# Altium project Pulse.PrjPCB
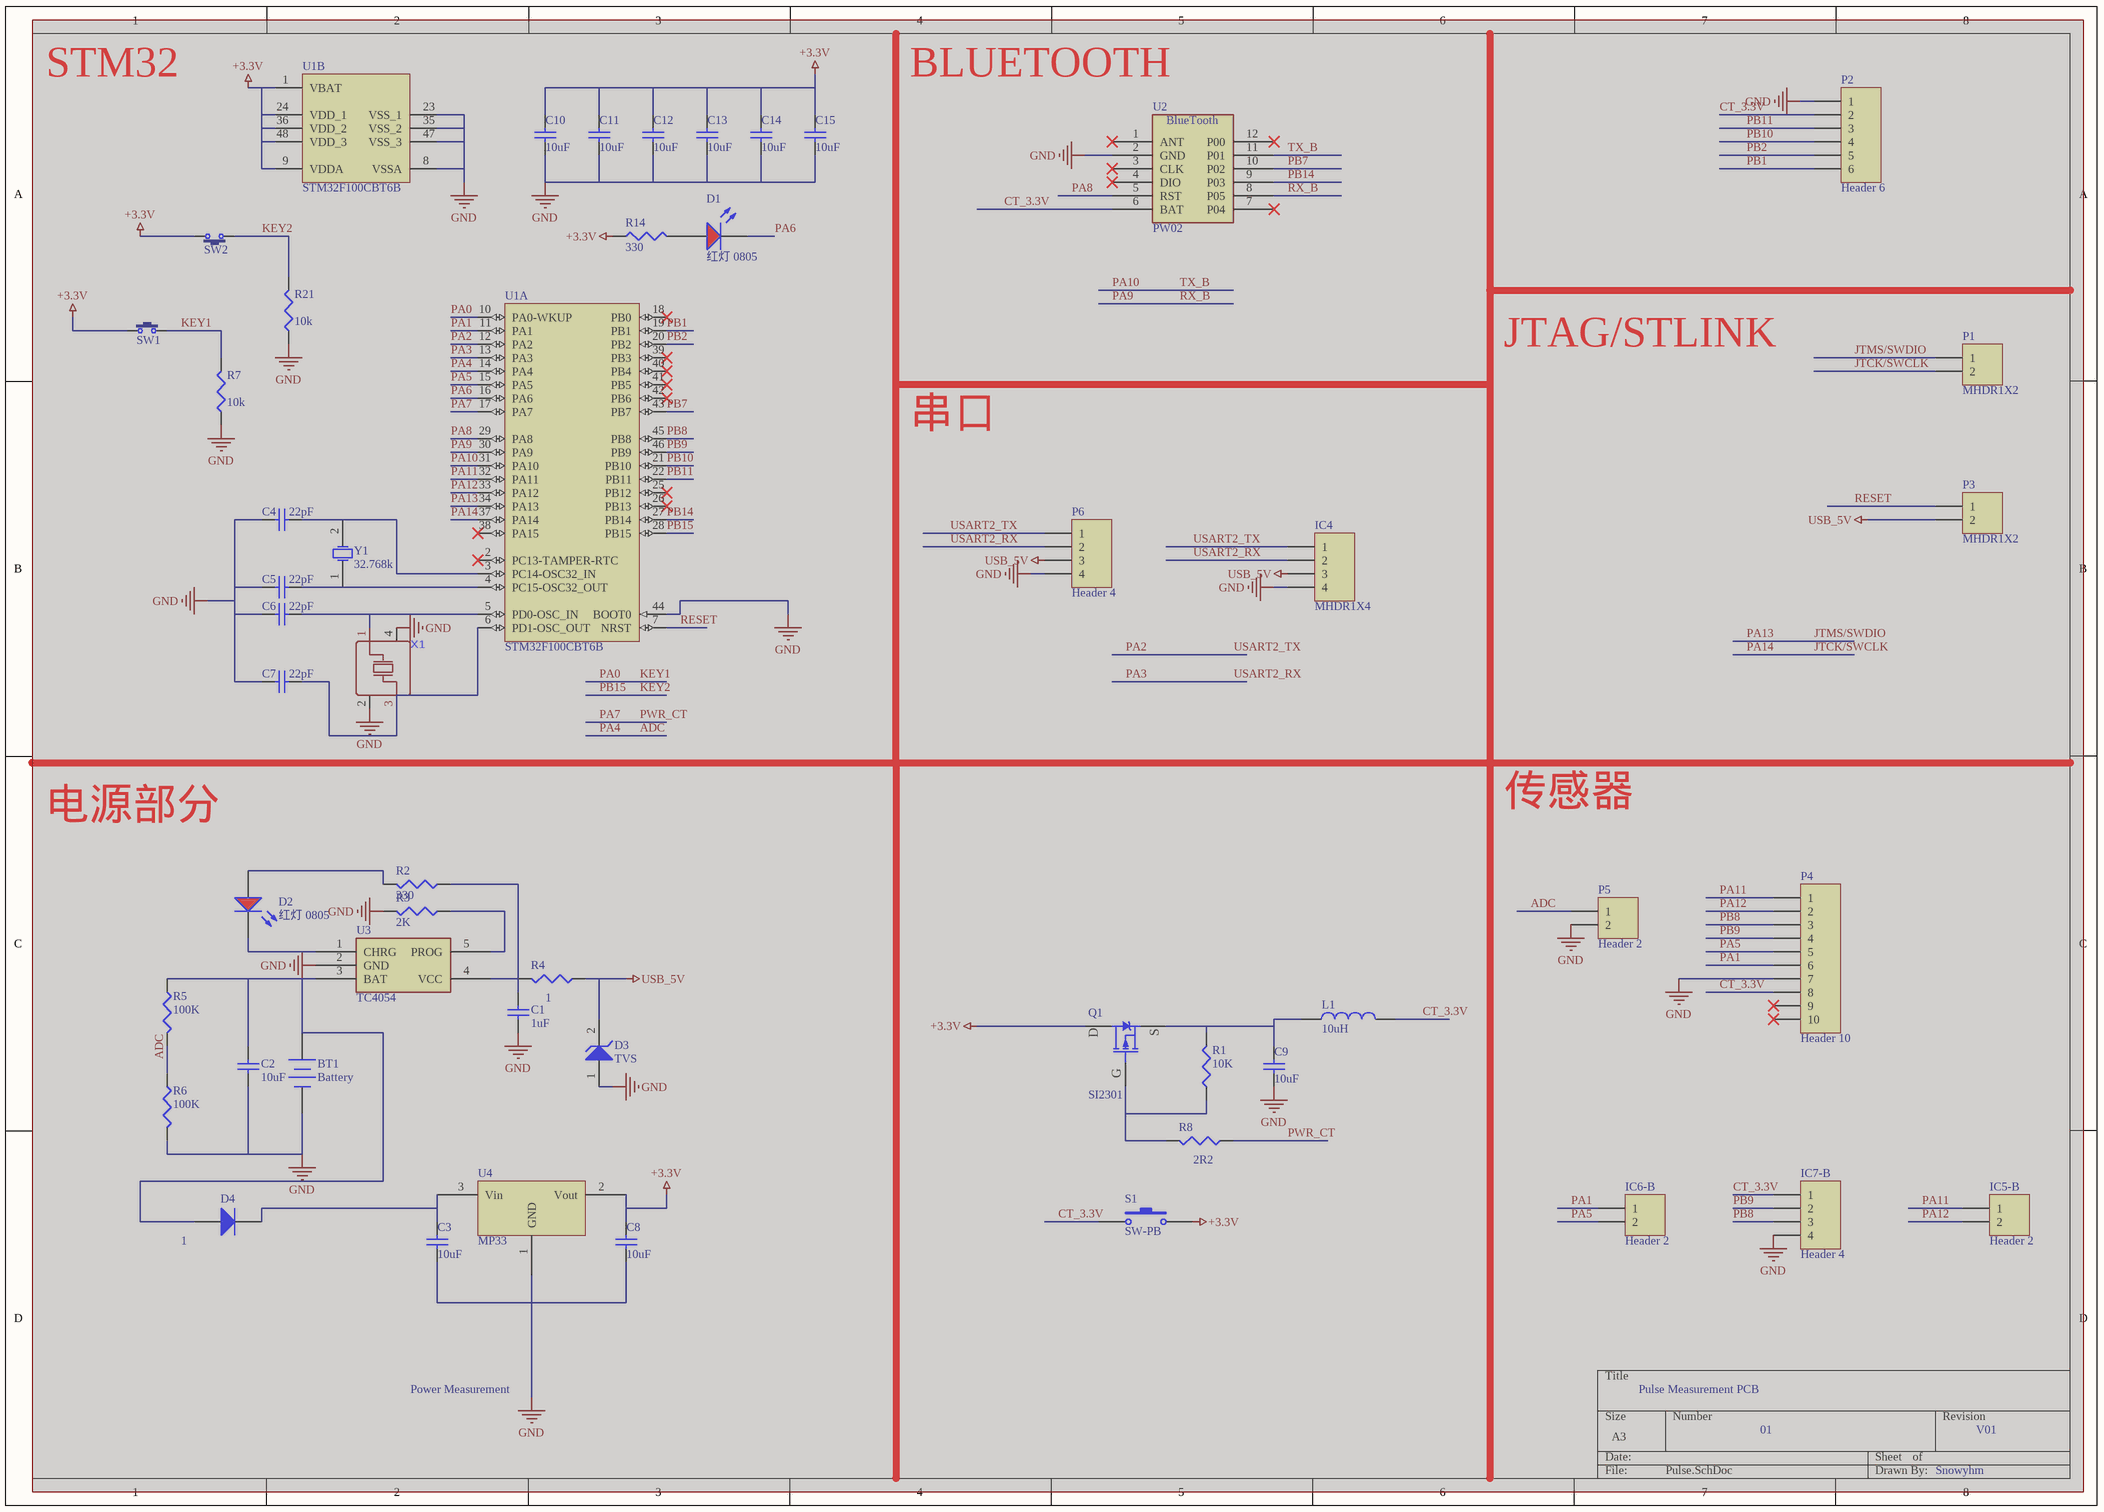
[diagram p0: Pulse.SchDoc]
3 sheets, 148 parts. Net scope: global (net labels, ports and power ports of the same name join across sheets).
Board file: Pulse.PcbDoc
Sheets:
  Pulse.SchDoc
  Pulse2.SchDoc
  Pulse3.SchDoc

## Sheet Pulse.SchDoc
size A3

### Parts
(Parts that share a designator on the sheet are numbered #1, #2 ... from top to bottom, then left to right.)
BT1#1  Battery  [BAT-2]  (masked out: inside a compile mask, not in the netlist)
C1#1  value 1uF  [LC-0603_C]  (hidden comment: Cap Semi)  (masked out: inside a compile mask, not in the netlist)
C2#1  value 10uF  [LC-0603_C]  (hidden comment: Cap Semi)  (masked out: inside a compile mask, not in the netlist)
C3#1  value 10uF  [LC-0603_C]  (hidden comment: Cap Semi)  (masked out: inside a compile mask, not in the netlist)
C4#1  value 22pF  [LC-0603_C]  (hidden comment: Cap Semi)  (masked out: inside a compile mask, not in the netlist)
C5#1  value 22pF  [LC-0603_C]  (hidden comment: Cap Semi)  (masked out: inside a compile mask, not in the netlist)
C6#1  value 22pF  [LC-0603_C]  (hidden comment: Cap Semi)  (masked out: inside a compile mask, not in the netlist)
C7#1  value 22pF  [LC-0603_C]  (hidden comment: Cap Semi)  (masked out: inside a compile mask, not in the netlist)
C8#1  value 10uF  [LC-0603_C]  (hidden comment: Cap Semi)  (masked out: inside a compile mask, not in the netlist)
C9#1  value 10uF  [LC-0603_C]  (hidden comment: Cap Semi)  (masked out: inside a compile mask, not in the netlist)
C10#1  value 10uF  [LC-0603_C]  (hidden comment: Cap Semi)  (masked out: inside a compile mask, not in the netlist)
C11#1  value 10uF  [LC-0603_C]  (hidden comment: Cap Semi)  (masked out: inside a compile mask, not in the netlist)
C12#1  value 10uF  [LC-0603_C]  (hidden comment: Cap Semi)  (masked out: inside a compile mask, not in the netlist)
C13#1  value 10uF  [LC-0603_C]  (hidden comment: Cap Semi)  (masked out: inside a compile mask, not in the netlist)
C14#1  value 10uF  [LC-0603_C]  (hidden comment: Cap Semi)  (masked out: inside a compile mask, not in the netlist)
C15#1  value 10uF  [LC-0603_C]  (hidden comment: Cap Semi)  (masked out: inside a compile mask, not in the netlist)
D1#1  红灯 0805  [LC-0805_LED_S1]  (masked out: inside a compile mask, not in the netlist)
D2  红灯 0805  [LC-0805_LED_S1]  (masked out: inside a compile mask, not in the netlist)
D3  TVS  [LC-SOD-123]  (masked out: inside a compile mask, not in the netlist)
D4  1  [LC-SOD-123]  (masked out: inside a compile mask, not in the netlist)
IC4#1  MHDR1X4  [MHDR1X4]  (masked out: inside a compile mask, not in the netlist)
IC5-B  Header 2  [HDR1X2]  (masked out: inside a compile mask, not in the netlist)
IC6-B  Header 2  [HDR1X2]  (masked out: inside a compile mask, not in the netlist)
IC7-B  Header 4  [HDR1X4]  (masked out: inside a compile mask, not in the netlist)
L1  10uH  [L 0805]  (masked out: inside a compile mask, not in the netlist)
P1  MHDR1X2  [MHDR1X2]  (masked out: inside a compile mask, not in the netlist)
P2  Header 6  [HDR1X6]  (masked out: inside a compile mask, not in the netlist)
P3  MHDR1X2  [MHDR1X2]  (masked out: inside a compile mask, not in the netlist)
P4  Header 10  [8P]  (masked out: inside a compile mask, not in the netlist)
P5  Header 2  [HDR1X2]  (masked out: inside a compile mask, not in the netlist)
P6  Header 4  [fpc_4p]  (masked out: inside a compile mask, not in the netlist)
Q1#1  SI2301  [SOT23-3N]  (masked out: inside a compile mask, not in the netlist)
R1#1  value 10K  [LC-0603_R]  (hidden comment: Res3)  (masked out: inside a compile mask, not in the netlist)
R2#1  value 330  [LC-0603_R]  (hidden comment: Res3)  (masked out: inside a compile mask, not in the netlist)
R3#1  value 2K  [LC-0603_R]  (hidden comment: Res3)  (masked out: inside a compile mask, not in the netlist)
R4#1  value 1  [LC-0603_R]  (hidden comment: Res3)  (masked out: inside a compile mask, not in the netlist)
R5#1  value 100K  [LC-0603_R]  (hidden comment: Res3)  (masked out: inside a compile mask, not in the netlist)
R6#1  value 100K  [LC-0603_R]  (hidden comment: Res3)  (masked out: inside a compile mask, not in the netlist)
R7#1  value 10k  [LC-0603_R]  (hidden comment: Res3)  (masked out: inside a compile mask, not in the netlist)
R8#1  value 2R2  [LC-0603_R]  (hidden comment: Res3)  (masked out: inside a compile mask, not in the netlist)
R14#1  value 330  [LC-0603_R]  (hidden comment: Res3)  (masked out: inside a compile mask, not in the netlist)
R21#1  value 10k  [LC-0603_R]  (hidden comment: Res3)  (masked out: inside a compile mask, not in the netlist)
S1  SW-PB  [SW-SMD_DSHP01TSGET]  (masked out: inside a compile mask, not in the netlist)
SW1#1  3x6x5  [button]  (value not drawn)  (masked out: inside a compile mask, not in the netlist)
SW2#1  3x6x5  [button]  (value not drawn)  (masked out: inside a compile mask, not in the netlist)
U1#1  STM32F100CBT6B  [STM-LQFP48_L]  (parts A,B of 2)  (masked out: inside a compile mask, not in the netlist)
U2#1  PW02  [bluetooth]  (masked out: inside a compile mask, not in the netlist)
U3#1  TC4054  [SOT23-5]  (masked out: inside a compile mask, not in the netlist)
U4#1  MP33  [LC-SOT-23(SOT-23-3)]  (masked out: inside a compile mask, not in the netlist)
X1  (no value)  [OSC 3225-4P]  (masked out: inside a compile mask, not in the netlist)
Y1#1  32.768k  [OSC 3215-2P]  (masked out: inside a compile mask, not in the netlist)

### Notes on the sheet
- STM32
- BLUETOOTH
- JTAG/STLINK
- 串口
- 电源部分
- 传感器
- Power Measurement
- Pulse Measurement PCB
- 01
- V01
- Snowyhm

### Library data of the parts
BT1#1 = Battery: Multicell Battery; Published: 24-Mar-1999; LatestRevisionDate: 17-Jul-2002; LatestRevisionNote: Re-released for DXP Platform.; PackageReference: BAT-2; Publisher: Altium Limited; PackageDescription: Battery; 2 Leads
C1#1 C2#1 C3#1 C4#1 C5#1 C6#1 C7#1 C8#1 C9#1 C10#1 C11#1 C12#1 C13#1 C14#1 C15#1 = Cap Semi: Capacitor (Semiconductor SIM Model); Published: 8-Jun-2000; LatestRevisionDate: 29-May-2009; LatestRevisionNote: IPC-7351 Footprint Added.; PackageReference: C1206; Publisher: Altium Limited; PackageDescription: Chip Capacitor
D1#1 D2 = 0805 红灯: 发光二极管; ComponentLink1Description: 供应商链接; ComponentLink1URL: http://www.szlcsc.com/product/details_2668.html; Package: 0805; Supplier: LC; SuppliersPartNumber: C2295
D3 = D Zener: Zener Diode; Published: 8-Jun-2000; LatestRevisionDate: 17-Jul-2002; LatestRevisionNote: Re-released for DXP Platform.; PackageReference: DIODE-0.7; Publisher: Altium Limited; PackageDescription: Diode, Thru-Hole; 2 Leads; 0.7 in Pin Spacing
D4 = SOD-323 1N4148WS T4: 二极管; ComponentLink1Description: 供应商链接; ComponentLink1URL: http://www.szlcsc.com/product/details_2485.html; Package: SOD-323; Supplier: LC; SuppliersPartNumber: C2128
IC4#1 = MHDR1X4: Header, 4-Pin; LatestRevisionDate: 17-Jul-2002; LatestRevisionNote: Re-released for DXP Platform.; Publisher: Altium Limited
IC5-B IC6-B P5 = Header 2: Header, 2-Pin; LatestRevisionDate: 17-Jul-2002; LatestRevisionNote: Re-released for DXP Platform.; Publisher: Altium Limited
IC7-B P6 = Header 4: Header, 4-Pin; LatestRevisionDate: 17-Jul-2002; LatestRevisionNote: Re-released for DXP Platform.; Publisher: Altium Limited
L1 = L: 小功率贴片电感; 淘宝ID: 封装库来自淘宝 ID：黄晶宝石; BOM名称: 小功率贴片电感; 联系售后: https://shop463601444.taobao.com
P1 P3 = MHDR1X2: Header, 2-Pin; LatestRevisionDate: 17-Jul-2002; LatestRevisionNote: Re-released for DXP Platform.; Publisher: Altium Limited
P2 = Header 6: Header, 6-Pin; LatestRevisionDate: 17-Jul-2002; LatestRevisionNote: Re-released for DXP Platform.; Publisher: Altium Limited
P4 = Header 10: Header, 10-Pin; LatestRevisionDate: 17-Jul-2002; LatestRevisionNote: Re-released for DXP Platform.; Publisher: Altium Limited
Q1#1 = SI2301: P沟道场效应管; BOM名称: P沟道场效应管; 学习资源: https://shop463601444.taobao.com
R1#1 R2#1 R3#1 R4#1 R5#1 R6#1 R7#1 R8#1 R14#1 R21#1 = Res3: Resistor; Published: 8-Jun-2000; LatestRevisionDate: 29-May-2009; LatestRevisionNote: IPC-7351 Footprint Added.; PackageReference: J1-0603; Publisher: Altium Limited; PackageDescription: Chip Resistor
S1 = SW-PB: Switch; Published: 24-Mar-1999; LatestRevisionDate: 17-Jul-2002; LatestRevisionNote: Re-released for DXP Platform.; PackageReference: SPST-2; Publisher: Altium Limited; PackageDescription: Switch; 2 Leads
SW1#1 SW2#1 = TSW 3x6: 3x6轻触开关; 免费技术支持，联系售后: 唯一出售店铺网址https://shop463601444.taobao.com; 封装库来自淘宝卖家 ID：黄晶宝石: 其他店铺购入均为盗版假冒封装库，请立即申请退款，本店3~10元现金奖励; BOM名称: 3x6轻触开关
U1#1 = STM32F100CBT6B: ARM Cortex-M3 32-bit MCU, 128 KB Flash, 8 KB Internal RAM, 37 I/Os, 48-pin LQFP, -40 to 85 degC, Tray; A/D Converter: 1x12-bit (10 Channel); D/A Converter: 2x12-bit (2 Channel); FLASH Size (Prog) (kB): 128; I/Os (High Current): 37; Internal RAM Size (kB): 8; Operating Frequency(F) (Processor speed) (MHz): 24; Supply Voltage(Vcc) min (V): 2; DatasheetVersion: Rev. 7; PackageVersion: Rev. 6, 06/2013; PackageReference: LQFP48; PackageDescription: 48-Pin Low Profile Quad Flat Package, 7 x 7 mm Body, 0.5 mm Pitch; Supplier 1: Digi-Key; Supplier Part Number 1: 497-10498-ND; Supplier 2: Farnell; Supplier Part Number 2: 1838512; Supplier 3: Newark; Supplier Part Number 3: 86R1308; Supplier 4: Newark; Supplier Part Number 4: 76R0985; Supplier 5: Mouser; Supplier Part Number 5: 511-STM32F100CBT6B; Core: ARM Cortex-M3; Packing: Tray; Mounting Technology: Surface Mount; PartNumber: STM32F100CBT6B; ComponentLink1Description: Manufacturer URL; ComponentLink1URL: http://www.st.com/web/en/home.html; ComponentLink2Description: Datasheet; ComponentLink2URL: http://www.st.com/st-web-ui/static/active/en/resource/technical/document/datasheet/CD00251732.pdf; ComponentLink3Description: Package Specification; ComponentLink3URL: http://www.st.com/st-web-ui/static/active/en/resource/technical/document/datasheet/DM00058181.pdf
U2#1 = PW02: BlueTooth
U4#1 = AMS1117: 三端稳压芯片
X1 = SMD-3225_4P12M12PF10PPM
Y1#1 = XTAL: Crystal Oscillator; Published: 8-Jun-2000; LatestRevisionDate: 17-Jul-2002; LatestRevisionNote: Re-released for DXP Platform.; PackageReference: R38; Publisher: Altium Limited; PackageDescription: Crystal, Thru-Hole; 2 Leads; Body 3.1 x 8.2 mm (Dia.xH)

## Sheet Pulse2.SchDoc
size A4
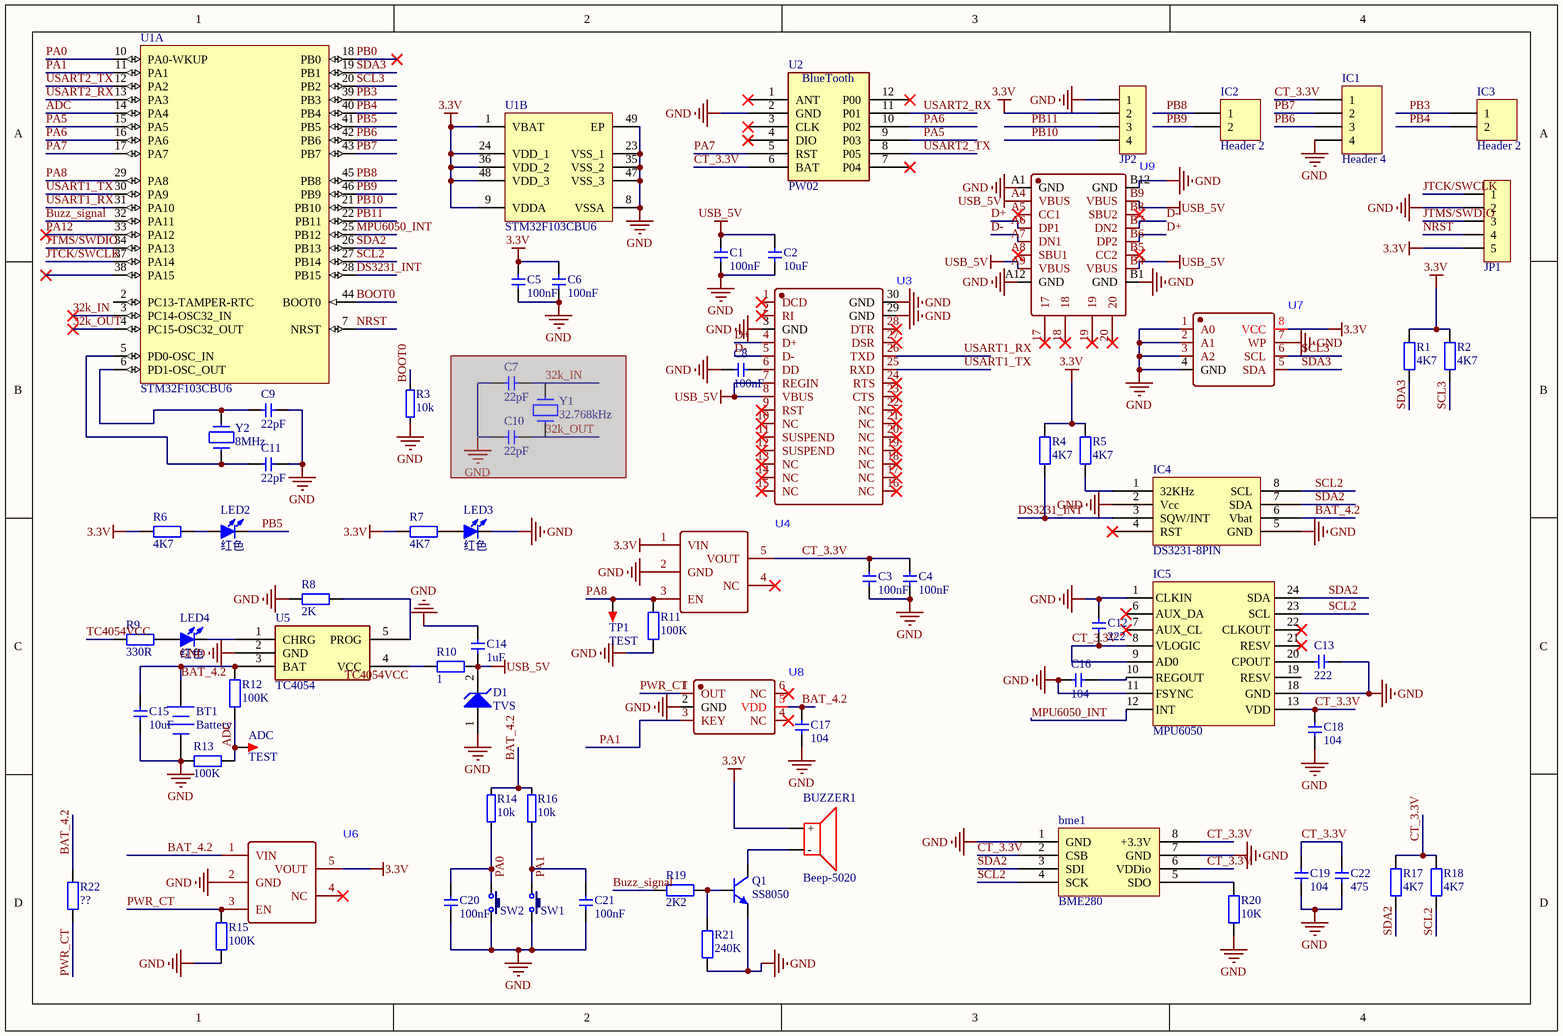
[diagram p1: Pulse2.SchDoc]

### Parts
(Parts that share a designator on the sheet are numbered #1, #2 ... from top to bottom, then left to right.)
ADC  TEST  [TEST 0.8]
bme1#1  BME280  [BME280]
BT1#2  Battery  [BAT-2]
BUZZER1#1  Beep-5020  [5020BUZZER]
C1#2  100nF  [C 0402_L]
C2#2  10uF  [C 0402_L]
C3#2  100nF  [C 0402_L]
C4#2  100nF  [C 0402_L]
C5#2  100nF  [C 0402_L]
C6#2  100nF  [C 0402_L]
C7#2  22pF  [C 0402_L]  (masked out: inside a compile mask, not in the netlist)
C8#2  100nF  [C 0402_L]
C9#2  22pF  [C 0402_L]
C10#2  22pF  [C 0402_L]  (masked out: inside a compile mask, not in the netlist)
C11#2  22pF  [C 0402_L]
C12#2  222  [C 0402_L]
C13#2  222  [C 0402_L]
C14#2  1uF  [C 0402_L]
C15#2  10uF  [C 0402_L]
C16#1  104  [C 0402_L]
C17#1  104  [C 0402_L]
C18#1  104  [C 0402_L]
C19#1  104  [C 0402_L]
C20  100nF  [C 0402_L]
C21  100nF  [C 0402_L]
C22#1  475  [C 0402_L]
D1#2  TVS  [LC-SOD-123]
IC1  Header 4  [HDR1X4]
IC2  Header 2  [HDR1X2]
IC3  Header 2  [HDR1X2]
IC4#2  DS3231-8PIN  [SOP8_N]
IC5#1  MPU6050  [QFN24 4x4_M]
JP1  HDR-1X5  [MX 1.25-LI-5P]  (value not drawn)
JP2  HDR-1X4  [HDR2.54-M-LI-4P]  (value not drawn)
LED2  红色  [LED 0603R]
LED3  红色  [LED 0603R]
LED4  红色  [LED 0603R]
Q1#2  SS8050  [SOT23-3N]
R1#2  4K7  [R 0402_L]
R2#2  4K7  [R 0402_L]
R3#2  10k  [R 0402_L]
R4#2  4K7  [R 0402_L]
R5#2  4K7  [R 0402_L]
R6#2  4K7  [R 0402_L]
R7#2  4K7  [R 0402_L]
R8#2  2K  [R 0402_L]
R9  330R  [R 0402_L]
R10  1  [R 1206_L]
R11  100K  [R 0402_L]
R12  100K  [R 0402_L]
R13  100K  [R 0402_L]
R14#2  10k  [R 0402_L]
R15  100K  [R 0402_L]
R16  10k  [R 0402_L]
R17#1  4K7  [R 0402_L]
R18#1  4K7  [R 0402_L]
R19#1  2K2  [R 0402_L]
R20#1  10K  [R 0402_L]
R21#2  240K  [R 0402_L]
R22  ??  [R 0402_L]
SW1#2  3x6x5  [button]  (value not drawn)
SW2#2  3x6x5  [button]  (value not drawn)
TP1  TEST  [TEST 1]
U1#2  STM32F103CBU6  [STMF103CBU6]  (parts A,B of 2)
U2#2  PW02  [bluetooth]
U3#2  (no value)  [CP2102]
U4#2  (no value)  [RT9013-33GB]
U5  TC4054  [SOT23-5]
U6  (no value)  [RT9013-33GB]
U7#1  (no value)  [AT24C256]
U8#1  (no value)  [EC190708]
U9  (no value)  [TYPE-C CB1.6]
Y1#2  32.768kHz  [OSC 3215-2P]  (masked out: inside a compile mask, not in the netlist)
Y2  8MHz  [OSC 5032-2P]

### Nets
3.3V: BUZZER1#1.1(+) C5#2.1 C6#2.1 JP1.5 JP2.2 R1#2.2 R2#2.2 R4#2.2 R5#2.2 R6#2.1 R7#2.1 U1#2.1(VBAT) U1#2.9(VDDA) U1#2.24(VDD_1) U1#2.36(VDD_2) U1#2.48(VDD_3) U4#2.1(VIN) U6.5(VOUT) U7#1.8(VCC)
GND: bme1#1.1(GND) bme1#1.7(GND) BT1#2.2(-) C1#2.2 C2#2.2 C3#2.2 C4#2.2 C5#2.2 C6#2.2 C8#2.2 C9#2.1 C11#2.1 C12#2.2 C13#2.2 C14#2.1 C15#2.2 C16#1.2 C17#1.2 C18#1.2 C19#1.2 C20.2 C21.2 C22#1.2 D1#2.1(A) IC1.4 IC4#2.2(Vcc) IC4#2.5(GND) IC5#1.1(CLKIN) IC5#1.11(FSYNC) IC5#1.18(GND) JP1.2 JP2.1 LED3.2(K) Q1#2.2(E) R3#2.2 R8#2.1 R11.1 R13.1 R15.1 R20#1.1 R21#2.1 SW1#2.2 SW2#2.2 U1#2.8(VSSA) U1#2.23(VSS_1) U1#2.35(VSS_2) U1#2.47(VSS_3) U1#2.49(EP) U2#2.2(GND) U3#2.3(GND) U3#2.29(GND) U3#2.30(GND) U4#2.2(GND) U5.2(GND) U6.2(GND) U7#1.1(A0) U7#1.2(A1) U7#1.3(A2) U7#1.4(GND) U7#1.7(WP) U8#1.2(GND) U9.A1(GND) U9.A12(GND) U9.B1(GND) U9.B12(GND)
USB_5V: C1#2.1 C2#2.1 C14#2.2 D1#2.2(K) R10.2 U3#2.7(REGIN) U3#2.8(VBUS) U9.A4(VBUS) U9.A9(VBUS) U9.B4(VBUS) U9.B9(VBUS)
32k_IN: U1#2.3(PC14-OSC32_IN)
32k_OUT: U1#2.4(PC15-OSC32_OUT)
ADC: ADC.1 R12.1 R13.2 U1#2.14(PA4)
BAT_4.2: BT1#2.1(+) C15#2.1 C17#1.1 IC4#2.6(Vbat) R12.2 R14#2.1 R16.1 R22.1 U5.3(BAT) U6.1(VIN) U8#1.5(VDD)
BOOT0: R3#2.1 U1#2.44(BOOT0)
Buzz_signal: R19#1.2 U1#2.32(PA11)
CT_3.3V: bme1#1.2(CSB) bme1#1.6(VDDio) bme1#1.8(+3.3V) C3#2.1 C4#2.1 C12#2.1 C18#1.1 C19#1.1 C22#1.1 IC1.1 IC5#1.8(VLOGIC) IC5#1.9(AD0) IC5#1.13(VDD) R17#1.2 R18#1.2 U2#2.6(BAT) U4#2.5(VOUT)
D+: U3#2.4(D+) U9.A6(DP1) U9.B6(DP2)
D-: U3#2.5(D-) U9.A7(DN1) U9.B7(DN2)
DS3231_INT: IC4#2.3(SQW/INT) R4#2.1 U1#2.28(PB15)
JTCK/SWCLK: JP1.1 U1#2.37(PA14)
JTMS/SWDIO: JP1.3 U1#2.34(PA13)
MPU6050_INT: IC5#1.12(INT) U1#2.25(PB12)
NRST: JP1.4 U1#2.7(NRST)
PA0: C20.1 R14#2.2 SW2#2.1 U1#2.10(PA0-WKUP)
PA1: C21.1 R16.2 SW1#2.1 U1#2.11(PA1) U8#1.3(KEY)
PA5: U1#2.15(PA5) U2#2.9(P03)
PA6: U1#2.16(PA6) U2#2.10(P02)
PA7: U1#2.17(PA7) U2#2.5(RST)
PA8: R11.2 TP1.1 U1#2.29(PA8) U4#2.3(EN)
PA12: U1#2.33(PA12)
PB0: U1#2.18(PB0)
PB3: IC3.1 U1#2.39(PB3)
PB4: IC3.2 U1#2.40(PB4)
PB5: LED2.2(K) U1#2.41(PB5)
PB6: IC1.3 U1#2.42(PB6)
PB7: IC1.2 U1#2.43(PB7)
PB8: IC2.1 U1#2.45(PB8)
PB9: IC2.2 U1#2.46(PB9)
PB10: JP2.4 U1#2.21(PB10)
PB11: JP2.3 U1#2.22(PB11)
PWR_CT: R15.2 R22.2 U6.3(EN) U8#1.1(OUT)
SCL2: bme1#1.4(SCK) IC4#2.8(SCL) IC5#1.23(SCL) R18#1.1 U1#2.27(PB14)
SCL3: R2#2.1 U1#2.20(PB2) U7#1.6(SCL)
SDA2: bme1#1.3(SDI) IC4#2.7(SDA) IC5#1.24(SDA) R17#1.1 U1#2.26(PB13)
SDA3: R1#2.1 U1#2.19(PB1) U7#1.5(SDA)
TC4054VCC: R9.1 R10.1 U5.4(VCC)
USART1_RX: U1#2.31(PA10) U3#2.26(TXD)
USART1_TX: U1#2.30(PA9) U3#2.25(RXD)
USART2_RX: U1#2.13(PA3) U2#2.11(P01)
USART2_TX: U1#2.12(PA2) U2#2.8(P05)
Netbme1#1_5: bme1#1.5(SDO) R20#1.2
NetBUZZER1#1_2: BUZZER1#1.2(-) Q1#2.3(C)
NetC8#2_1: C8#2.1 U3#2.6(DD)
NetC9#2_2: C9#2.2 U1#2.6(PD1-OSC_OUT) Y2.1
NetC11#2_2: C11#2.2 U1#2.5(PD0-OSC_IN) Y2.2
NetC13#2_1: C13#2.1 IC5#1.20(CPOUT)
NetC16#1_1: C16#1.1 IC5#1.10(REGOUT)
NetIC4#2_1: IC4#2.1(32KHz) R5#2.1
NetLED2_1: LED2.1(A) R6#2.2
NetLED3_1: LED3.1(A) R7#2.2
NetLED4_1: LED4.1(A) R9.2
NetLED4_2: LED4.2(K) U5.1(CHRG)
NetQ1#2_1: Q1#2.1(B) R19#1.1 R21#2.2
NetR8#2_2: R8#2.2 U5.5(PROG)

Not connected (* = marked no-connect by the designer): IC4#2 4(RST)*; IC5#1 6(AUX_DA)* 7(AUX_CL)* 19(RESV) 21(RESV)* 22(CLKOUT)*; U1#2 2(PC13-TAMPER-RTC) 38(PA15)*; U2#2 1(ANT)* 3(CLK)* 4(DIO)* 7(P04)* 12(P00)*; U3#2 1(DCD)* 2(RI)* 9(RST)* 10(NC)* 11(SUSPEND)* 12(SUSPEND)* 13(NC)* 14(NC)* 15(NC)* 16(NC)* 17(NC)* 18(NC)* 19(NC)* 20(NC)* 21(NC)* 22(NC)* 23(CTS)* 24(RTS)* 27(DSR)* 28(DTR)*; U4#2 4(NC)*; U6 4(NC)*; U8#1 4(NC)* 6(NC)*; U9 17* 18* 19* 20* A5(CC1)* A8(SBU1)* B5(CC2)* B8(SBU2)*

### Library data of the parts
ADC TP1 = TEST: 测试点; 版权归属: 封装库来自淘宝 ID：黄晶宝石; BOM名称: 测试点; 学习资源: https://shop463601444.taobao.com
bme1#1 = BME280: 气压，湿度，温度传感器
BT1#2 = Battery: Multicell Battery; Published: 24-Mar-1999; LatestRevisionDate: 17-Jul-2002; LatestRevisionNote: Re-released for DXP Platform.; PackageReference: BAT-2; Publisher: Altium Limited; PackageDescription: Battery; 2 Leads
BUZZER1#1 = Beep-5020: 贴片蜂鸣器5020最小封装
C1#2 C2#2 C3#2 C4#2 C5#2 C6#2 C7#2 C8#2 C9#2 C10#2 C11#2 C12#2 C13#2 C14#2 C15#2 C16#1 C17#1 C18#1 C19#1 C20 C21 C22#1 = C
D1#2 = D Zener: Zener Diode; Published: 8-Jun-2000; LatestRevisionDate: 17-Jul-2002; LatestRevisionNote: Re-released for DXP Platform.; PackageReference: DIODE-0.7; Publisher: Altium Limited; PackageDescription: Diode, Thru-Hole; 2 Leads; 0.7 in Pin Spacing
IC1 = Header 4: Header, 4-Pin; LatestRevisionDate: 17-Jul-2002; LatestRevisionNote: Re-released for DXP Platform.; Publisher: Altium Limited
IC2 IC3 = Header 2: Header, 2-Pin; LatestRevisionDate: 17-Jul-2002; LatestRevisionNote: Re-released for DXP Platform.; Publisher: Altium Limited
IC5#1 = MPU6050: 陀螺仪
JP1 = Header 5: 5P接插件; 学习资源: 封装库来自淘宝 ID：黄晶宝石; BOM名称: 5P接插件; 联系售后: https://shop463601444.taobao.com
JP2 = Header 4: 4P接插件; 版权归属: 封装库来自淘宝 ID：黄晶宝石; BOM名称: 4P接插件; 学习资源: https://shop463601444.taobao.com
LED2-LED4 = LED-SMD: 贴片LED; 版权归属: 封装库来自淘宝 ID：黄晶宝石; BOM名称: 贴片LED; 学习资源: https://shop463601444.taobao.com
Q1#2 = 8050-SMD: 高频放大-NPN型; 版权归属: 源创客; 属性: 40V 1.5A 1W 100MHZ; BOM名称: 高频放大-NPN型; 学习资源: www.ooocke.com
R1#2 R2#2 R4#2 R5#2 R6#2 R7#2 R8#2 R9-R13 R15 R17#1 R18#1 R19#1 R20#1 R21#2 R22 = R: 贴片电阻; 版权归属: 来自淘宝 ID：黄晶宝石; BOM名称: 贴片电阻; 联系售后: https://shop463601444.taobao.com
R3#2 R14#2 R16 = R
SW1#2 SW2#2 = TSW 3x6: as SW1#1 on sheet Pulse; BOM名称: 3x6轻触开关
U1#2 = STM32F103CBU6: ARM Cortex-M3 32-bit MCU, 128 KB Flash, 20 KB Internal RAM, 37 I/Os, 48-pin UFQFPN, -40 to 85 degC, Tray; A/D Converter: 2x12-bit (10 Channel); FLASH Size (Prog) (kB): 128; I/Os (High Current): 37; Internal RAM Size (kB): 20; Operating Frequency(F) (Processor speed) (MHz): 72; Supply Voltage(Vcc) min (V): 2; DatasheetVersion: Rev. 16; PackageVersion: Rev. 1, 04/2013; PackageReference: UFQFPN48; PackageDescription: 48-Pin Ultra Thin Fine Pitch Quad Flat No-Lead, 7 x 7 x 0.6 mm Body, 0.5 mm Pitch, Exposed Pad; Supplier 1: Digi-Key; Supplier Part Number 1: STM32F103CBU6-ND; Supplier 2: Farnell; Supplier Part Number 2: 2060891; Supplier 3: Newark; Supplier Part Number 3: 65T3772; Supplier 4: Newark; Supplier Part Number 4: 73T2300; Supplier 5: Mouser; Supplier Part Number 5: 511-STM32F103CBU6; Core: ARM Cortex-M3; Packing: Tray; Mounting Technology: Surface Mount; PartNumber: STM32F103CBU6; ComponentLink1Description: Manufacturer URL; ComponentLink1URL: http://www.st.com/web/en/home.html; ComponentLink2Description: Datasheet; ComponentLink2URL: http://www.st.com/st-web-ui/static/active/en/resource/technical/document/datasheet/CD00161566.pdf; ComponentLink3Description: Package Specification; ComponentLink3URL: http://www.st.com/st-web-ui/static/active/en/resource/technical/document/data_brief/DM00071938.pdf
U2#2 = PW02: BlueTooth
U3#2 = CP2102-GMR-YJLTY
U4#2 U6 = RT9013-33GB
U7#1 = AT24C256C-SSHL-T
U8#1 = EC190708
U9 = USB-TYPE_C16P沉
Y1#2 Y2 = CRYSTAL

## Sheet Pulse3.SchDoc
size A4
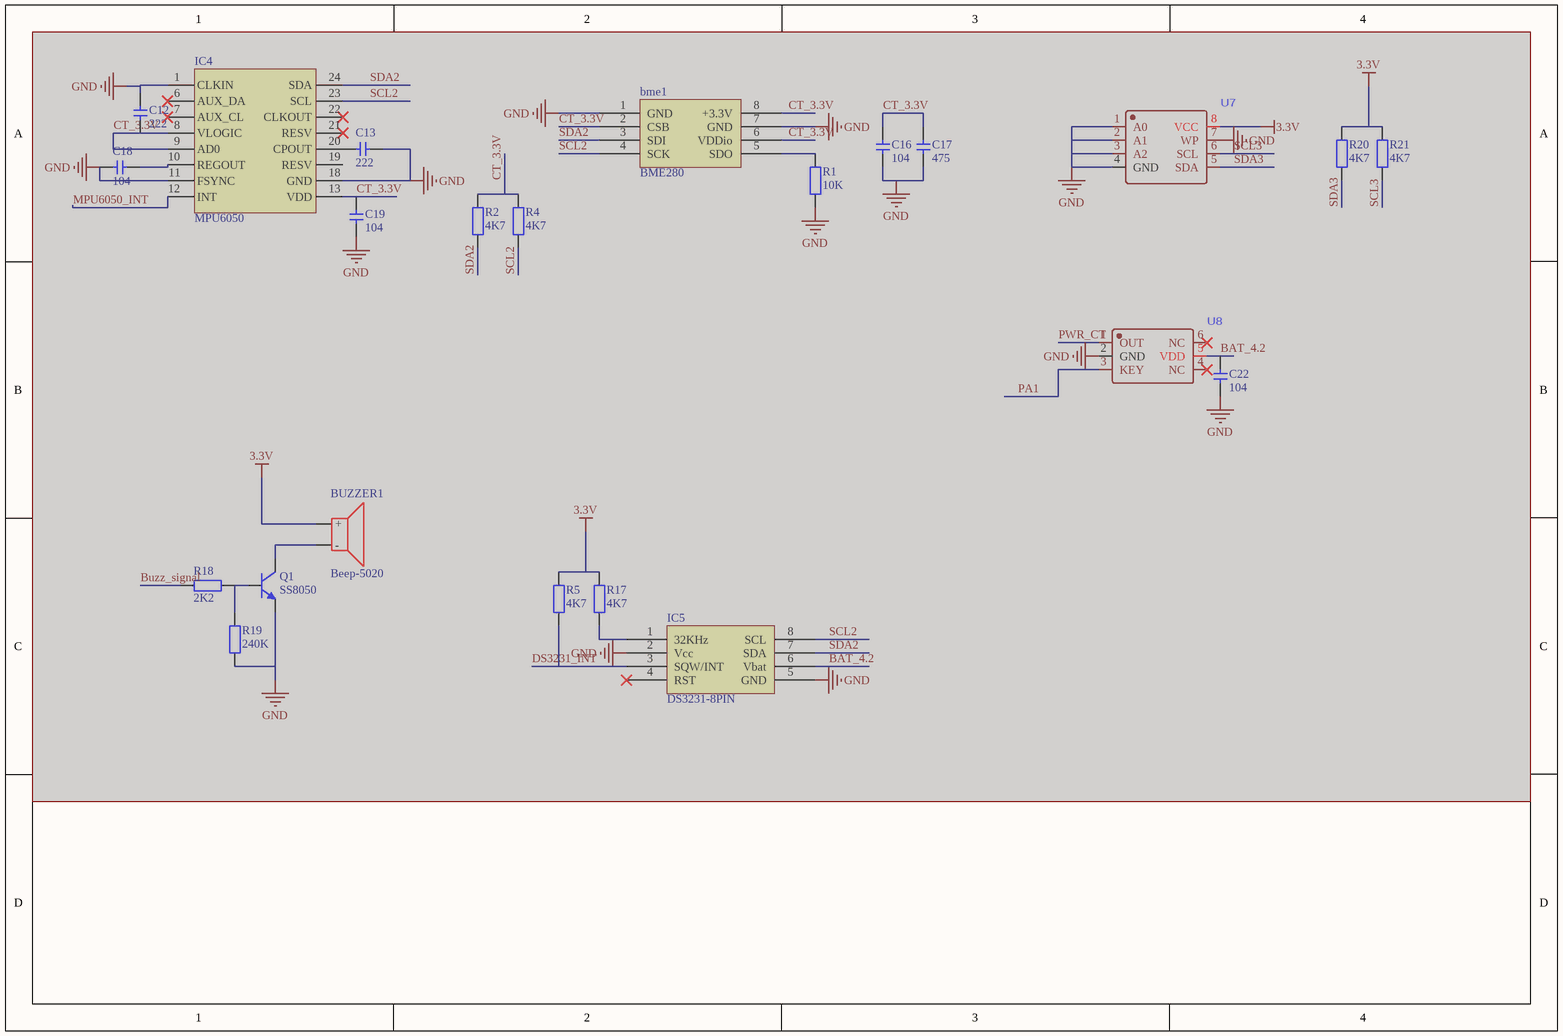
[diagram p2: Pulse3.SchDoc]

### Parts
(Parts that share a designator on the sheet are numbered #1, #2 ... from top to bottom, then left to right.)
bme1#2  BME280  [BME280]  (masked out: inside a compile mask, not in the netlist)
BUZZER1#2  Beep-5020  [5020BUZZER]  (masked out: inside a compile mask, not in the netlist)
C12#3  222  [C 0402_L]  (masked out: inside a compile mask, not in the netlist)
C13#3  222  [C 0402_L]  (masked out: inside a compile mask, not in the netlist)
C16#2  104  [C 0402_L]  (masked out: inside a compile mask, not in the netlist)
C17#2  475  [C 0402_L]  (masked out: inside a compile mask, not in the netlist)
C18#2  104  [C 0402_L]  (masked out: inside a compile mask, not in the netlist)
C19#2  104  [C 0402_L]  (masked out: inside a compile mask, not in the netlist)
C22#2  104  [C 0402_L]  (masked out: inside a compile mask, not in the netlist)
IC4#3  MPU6050  [QFN24 4x4_M]  (masked out: inside a compile mask, not in the netlist)
IC5#2  DS3231-8PIN  [SOP8_N]  (masked out: inside a compile mask, not in the netlist)
Q1#3  SS8050  [SOT23-3N]  (masked out: inside a compile mask, not in the netlist)
R1#3  10K  [R 0402_L]  (masked out: inside a compile mask, not in the netlist)
R2#3  4K7  [R 0402_L]  (masked out: inside a compile mask, not in the netlist)
R4#3  4K7  [R 0402_L]  (masked out: inside a compile mask, not in the netlist)
R5#3  4K7  [R 0402_L]  (masked out: inside a compile mask, not in the netlist)
R17#2  4K7  [R 0402_L]  (masked out: inside a compile mask, not in the netlist)
R18#2  2K2  [R 0402_L]  (masked out: inside a compile mask, not in the netlist)
R19#2  240K  [R 0402_L]  (masked out: inside a compile mask, not in the netlist)
R20#2  4K7  [R 0402_L]  (masked out: inside a compile mask, not in the netlist)
R21#3  4K7  [R 0402_L]  (masked out: inside a compile mask, not in the netlist)
U7#2  (no value)  [AT24C256]  (masked out: inside a compile mask, not in the netlist)
U8#2  (no value)  [EC190708]  (masked out: inside a compile mask, not in the netlist)

### Library data of the parts
bme1#2 = BME280: 气压，湿度，温度传感器
BUZZER1#2 = Beep-5020: 贴片蜂鸣器5020最小封装
C12#3 C13#3 C16#2 C17#2 C18#2 C19#2 C22#2 = C
IC4#3 = MPU6050: 陀螺仪
Q1#3 = 8050-SMD: as Q1#2 on sheet Pulse2; BOM名称: 高频放大-NPN型; 学习资源: www.ooocke.com
R1#3 R2#3 R4#3 R5#3 R17#2 R18#2 R19#2 R20#2 R21#3 = R: 贴片电阻; 版权归属: 来自淘宝 ID：黄晶宝石; BOM名称: 贴片电阻; 联系售后: https://shop463601444.taobao.com
U7#2 = AT24C256C-SSHL-T
U8#2 = EC190708